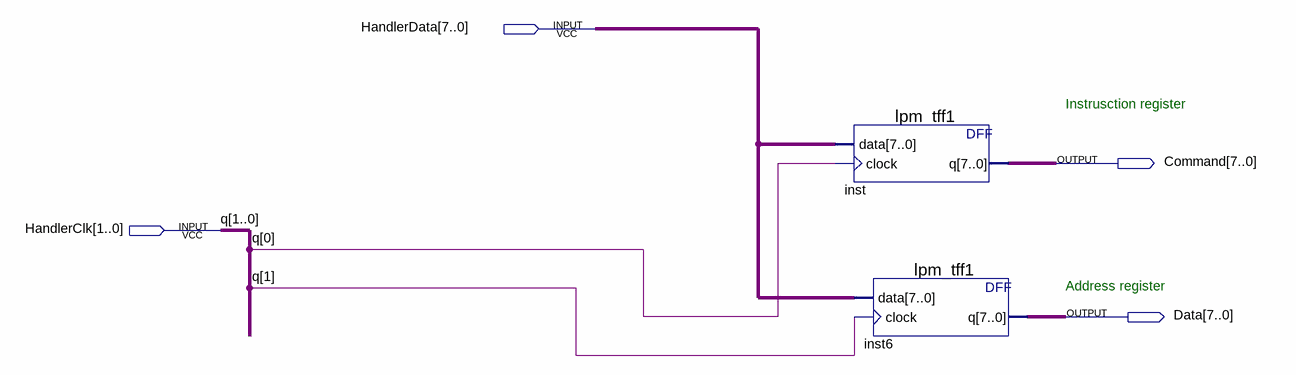
[diagram p0: schematic sheet]
// Quartus schematic CommandHandler.bdf as structural Verilog: 2 symbols, 4 pins
module CommandHandler (
  input  [7:0] HandlerData,
  input  [1:0] HandlerClk,
  output [7:0] Command,
  output [7:0] Data
);

  lpm_tff1 inst (.data(HandlerData), .clock(HandlerClk[0]), .q(Command));
  lpm_tff1 inst6 (.data(HandlerData), .clock(HandlerClk[1]), .q(Data));

  // Other names for the same wires on the sheet: q[1:0] = HandlerClk

  // Notes on the sheet:
  //   Instrusction register
  //   Address register
endmodule
